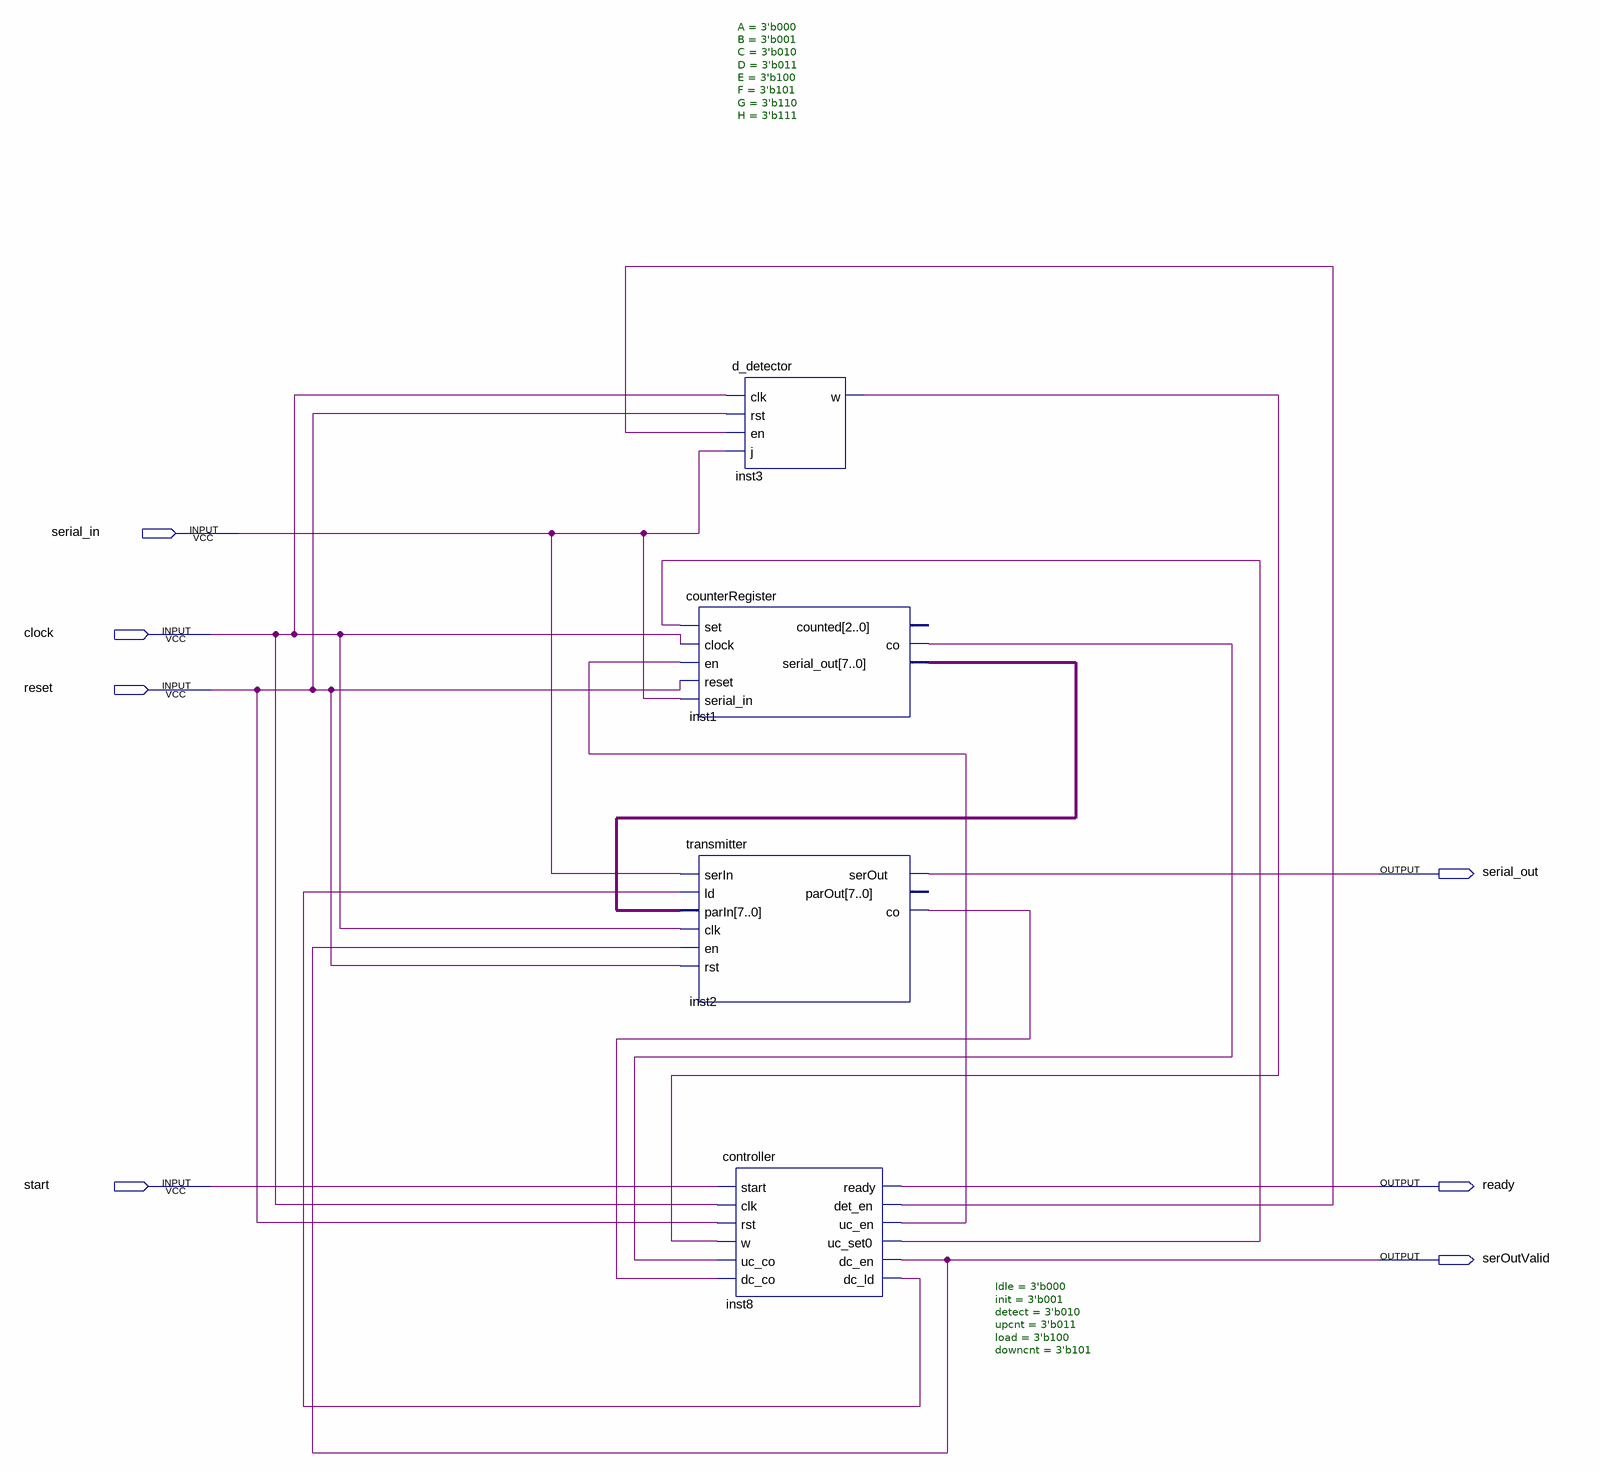
[diagram p0: schematic sheet]
// Quartus schematic serial_transmitter_circuit.bdf as structural Verilog: 4 symbols, 7 pins
module serial_transmitter_circuit (
  input  serial_in,
  input  clock,
  input  reset,
  input  start,
  output serial_out,
  output ready,
  output serOutValid
);

  wire inst1_co, inst2_co, inst3_w, inst8_dc_ld, inst8_det_en, inst8_uc_en, inst8_uc_set0;
  wire [7:0] inst1_serial_out;

  counterRegister inst1 (
    .set(inst8_uc_set0), .clock(clock), .en(inst8_uc_en), .reset(reset), .serial_in(serial_in),
    .co(inst1_co), .serial_out(inst1_serial_out));  // open: counted
  transmitter inst2 (
    .serIn(serial_in), .ld(inst8_dc_ld), .parIn(inst1_serial_out), .clk(clock), .en(serOutValid),
    .rst(reset), .serOut(serial_out), .co(inst2_co));  // open: parOut
  d_detector #(.A(3'b000), .B(3'b001), .C(3'b010), .D(3'b011), .E(3'b100), .F(3'b101), .G(3'b110), .H(3'b111)) inst3 (
    .clk(clock), .rst(reset), .en(inst8_det_en), .j(serial_in), .w(inst3_w));
  controller #(.Idle(3'b000), .init(3'b001), .detect(3'b010), .upcnt(3'b011), .load(3'b100), .downcnt(3'b101)) inst8 (
    .start(start), .clk(clock), .rst(reset), .w(inst3_w), .uc_co(inst1_co), .dc_co(inst2_co), .ready(ready),
    .det_en(inst8_det_en), .uc_en(inst8_uc_en), .uc_set0(inst8_uc_set0), .dc_en(serOutValid),
    .dc_ld(inst8_dc_ld));
endmodule
